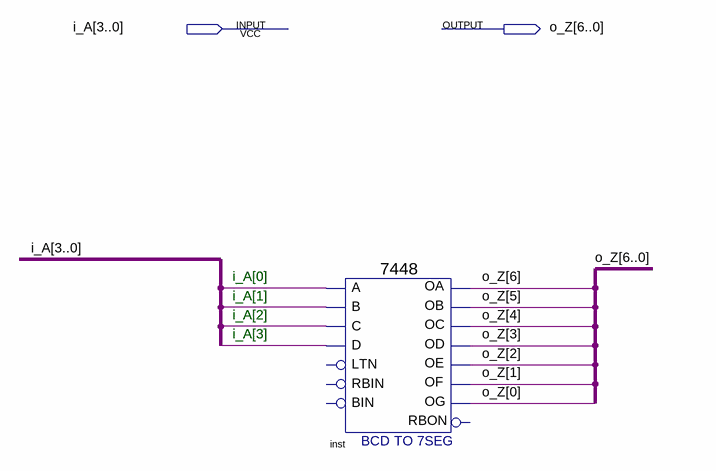
[diagram p0: schematic sheet]
// Quartus schematic ttl7448.bdf as structural Verilog: 1 symbols, 2 pins
module ttl7448 (
  input  [3:0] i_A,
  output [6:0] o_Z
);

  \7448  inst (
    .A(i_A[0]), .C(i_A[2]), .D(i_A[3]), .B(i_A[1]), .OC(o_Z[4]), .OE(o_Z[2]), .OD(o_Z[3]), .OF(o_Z[1]),
    .OG(o_Z[0]), .OB(o_Z[5]), .OA(o_Z[6]));  // open: RBIN, BIN, LTN, RBON

  // Notes on the sheet:
  //   i_A[0]
  //   i_A[1]
  //   i_A[2]
  //   i_A[3]
endmodule
